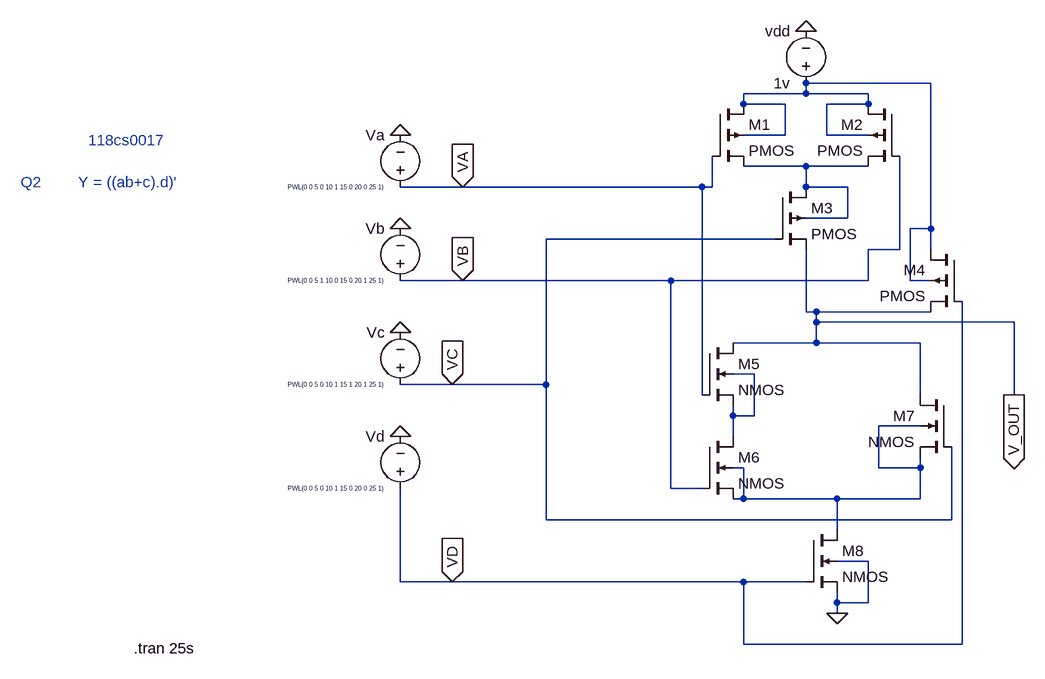
[diagram p0: schematic Draft14.asc]
Draft14.asc, the LTspice schematic file:
Version 4
SHEET 1 880 920
WIRE 400 32 208 32
WIRE 208 48 208 32
WIRE 208 48 112 48
WIRE 304 48 208 48
WIRE 112 64 112 48
WIRE 176 64 112 64
WIRE 304 64 304 48
WIRE 304 64 240 64
WIRE 176 112 176 64
WIRE 176 112 112 112
WIRE 240 112 240 64
WIRE 304 112 240 112
WIRE 208 160 112 160
WIRE 304 160 208 160
WIRE -320 192 -416 192
WIRE 48 192 -320 192
WIRE 64 192 64 144
WIRE 64 192 48 192
WIRE 208 192 208 160
WIRE 272 192 208 192
WIRE 272 240 272 192
WIRE 272 240 208 240
WIRE 400 256 400 32
WIRE 400 256 368 256
WIRE 160 272 -192 272
WIRE 352 288 352 144
WIRE 352 288 304 288
WIRE 400 288 400 256
WIRE -320 336 -416 336
WIRE 0 336 -320 336
WIRE 304 336 304 288
WIRE 304 336 0 336
WIRE 368 336 368 256
WIRE 400 336 368 336
WIRE 208 384 208 288
WIRE 224 384 208 384
WIRE 400 384 224 384
WIRE 224 400 224 384
WIRE 528 400 224 400
WIRE 224 432 224 400
WIRE 224 432 96 432
WIRE 384 432 224 432
WIRE 128 480 96 480
WIRE -336 496 -416 496
WIRE -192 496 -192 272
WIRE -192 496 -336 496
WIRE 48 512 48 192
WIRE 384 512 384 432
WIRE 528 512 528 400
WIRE 96 544 96 528
WIRE 128 544 128 480
WIRE 128 544 96 544
WIRE 384 560 320 560
WIRE 96 576 96 544
WIRE 112 624 96 624
WIRE 320 624 320 560
WIRE 384 624 384 608
WIRE 384 624 320 624
WIRE 0 656 0 336
WIRE 48 656 0 656
WIRE 112 672 112 624
WIRE 112 672 96 672
WIRE 256 672 112 672
WIRE 384 672 384 624
WIRE 384 672 256 672
WIRE -192 704 -192 496
WIRE 432 704 432 592
WIRE 432 704 -192 704
WIRE 256 720 256 672
WIRE 304 768 256 768
WIRE -416 800 -416 656
WIRE -336 800 -416 800
WIRE 112 800 -336 800
WIRE 208 800 112 800
WIRE 256 832 256 816
WIRE 304 832 304 768
WIRE 304 832 256 832
WIRE 256 848 256 832
WIRE 112 896 112 800
WIRE 448 896 448 368
WIRE 448 896 112 896
FLAG 208 -48 0
FLAG 528 512 V_OUT
IOPIN 528 512 Out
FLAG 256 848 0
FLAG -416 112 0
FLAG -416 256 0
FLAG -416 416 0
FLAG -416 576 0
FLAG -320 192 VA
IOPIN -320 192 In
FLAG -320 336 VB
IOPIN -320 336 In
FLAG -336 496 VC
IOPIN -336 496 In
FLAG -336 800 VD
IOPIN -336 800 In
SYMBOL pmos4 64 64 R0
SYMATTR InstName M1
SYMBOL pmos4 352 64 M0
SYMATTR InstName M2
SYMBOL pmos4 160 192 R0
SYMATTR InstName M3
SYMBOL pmos4 448 288 M0
SYMATTR InstName M4
SYMBOL voltage 208 48 R180
WINDOW 0 24 96 Left 2
WINDOW 3 24 16 Left 2
SYMATTR InstName vdd
SYMATTR Value 1v
SYMBOL nmos4 48 432 R0
SYMATTR InstName M5
SYMBOL nmos4 48 576 R0
SYMATTR InstName M6
SYMBOL nmos4 432 512 M0
SYMATTR InstName M7
SYMBOL nmos4 208 720 R0
SYMATTR InstName M8
SYMBOL voltage -416 672 R180
WINDOW 0 24 96 Left 2
WINDOW 3 24 16 Left 0
WINDOW 123 0 0 Left 0
WINDOW 39 0 0 Left 0
SYMATTR InstName Vd
SYMATTR Value PWL(0 0 5 0 10 1 15 0 20 0 25 1)
SYMBOL voltage -416 512 R180
WINDOW 0 24 96 Left 2
WINDOW 3 24 16 Left 0
WINDOW 123 0 0 Left 0
WINDOW 39 0 0 Left 0
SYMATTR InstName Vc
SYMATTR Value PWL(0 0 5 0 10 1 15 1 20 1 25 1)
SYMBOL voltage -416 352 R180
WINDOW 0 24 96 Left 2
WINDOW 3 24 16 Left 0
WINDOW 123 0 0 Left 0
WINDOW 39 0 0 Left 0
SYMATTR InstName Vb
SYMATTR Value PWL(0 0 5 1 10 0 15 0 20 1 25 1)
SYMBOL voltage -416 208 R180
WINDOW 0 24 96 Left 2
WINDOW 3 24 16 Left 0
WINDOW 123 0 0 Left 0
WINDOW 39 0 0 Left 0
SYMATTR InstName Va
SYMATTR Value PWL(0 0 5 0 10 1 15 0 20 0 25 1)
TEXT -826 902 Left 2 !.tran 25s
TEXT -896 120 Left 2 ;118cs0017
TEXT -912 184 Left 2 ;Y = ((ab+c).d)'
TEXT -1000 184 Left 2 ;Q2

The netlist it stands for:
* Draft14.asc
M1 N001 VA N002 N001 PMOS
M2 N001 VB N002 N001 PMOS
M3 N002 VC V_OUT N002 PMOS
M4 N001 VD V_OUT N001 PMOS
vdd N001 0 1v
M5 V_OUT VA N003 N003 NMOS
M6 N003 VB N004 N004 NMOS
M7 V_OUT VC N004 N004 NMOS
M8 N004 VD 0 0 NMOS
Vd VD 0 PWL(0 0 5 0 10 1 15 0 20 0 25 1)
Vc VC 0 PWL(0 0 5 0 10 1 15 1 20 1 25 1)
Vb VB 0 PWL(0 0 5 1 10 0 15 0 20 1 25 1)
Va VA 0 PWL(0 0 5 0 10 1 15 0 20 0 25 1)
.model NMOS NMOS
.model PMOS PMOS
.lib standard.mos
.tran 25s
* 118cs0017
* Y = ((ab+c).d)'
* Q2
.backanno
.end